# Altium project UZ_PER_SKAI3_LV_48V_410A.PrjPCB (part 2 of 2)

## Sheet Power.SchDoc
size A4; Author: D. Hufnagel; CompanyName: Technische Hochschule Nürnberg Georg Simon Ohm; Organization: UltraZohm; Address1: Kesslerplatz 12; Address2: 90489 Nürnberg; Address3: GERMANY; SheetNumber: 4; SheetTotal: 7; Website: www.ultrazohm.com
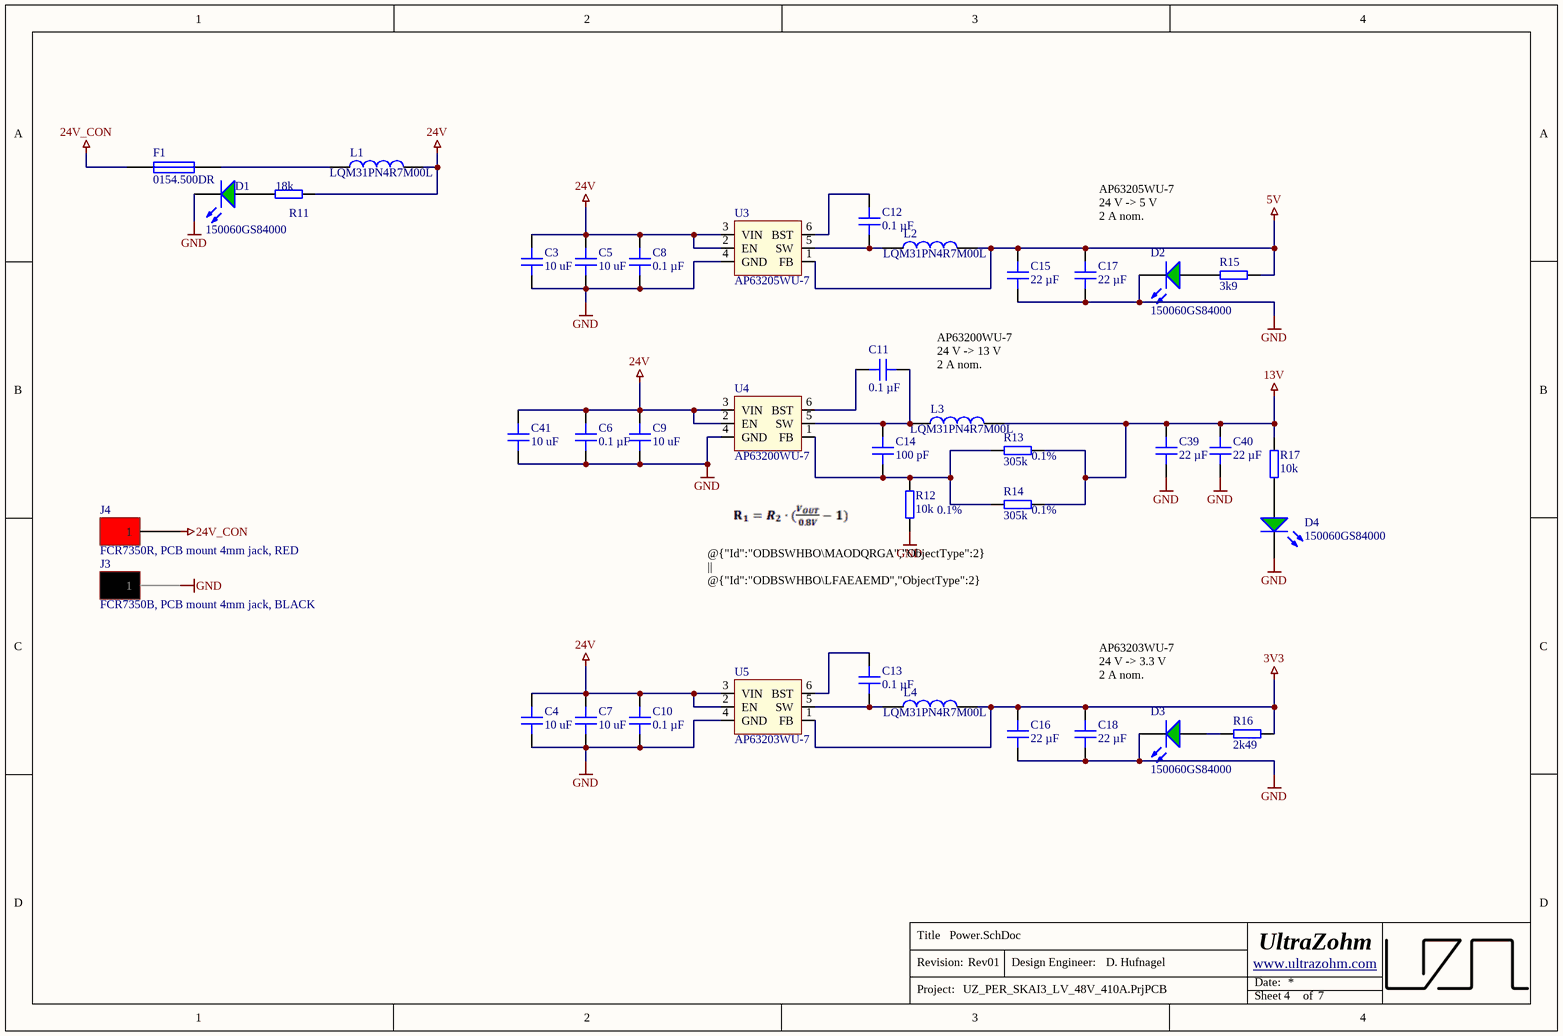
[diagram p6: Power.SchDoc]

### Parts
C3  10 uF  [C_1206]
C4  10 uF  [C_1206]
C5  10 uF  [C_1206]
C6  0.1 µF  [C_0603]
C7  10 uF  [C_1206]
C8  0.1 µF  [C_0603]
C9  10 uF  [C_1206]
C10  0.1 µF  [C_0603]
C11  0.1 µF  [C_0603]
C12  0.1 µF  [C_0603]
C13  0.1 µF  [C_0603]
C14  100 pF  [C_0603]
C15  22 µF  [C_0805]
C16  22 µF  [C_0805]
C17  22 µF  [C_0805]
C18  22 µF  [C_0805]
C39  22 µF  [C_0805]
C40  22 µF  [C_0805]
C41  10 uF  [C_1206]
D1  150060GS84000  [WL-SMCW_0603]
D2  150060GS84000  [WL-SMCW_0603]
D3  150060GS84000  [WL-SMCW_0603]
D4  150060GS84000  [WL-SMCW_0603]
F1  0154.500DR  [Littlefuse_154]
J3  FCR7350B, PCB mount 4mm jack, BLACK  [FCR7350]
J4  FCR7350R, PCB mount 4mm jack, RED  [FCR7350]
L1  LQM31PN4R7M00L  [IND 1206_3216]
L2  LQM31PN4R7M00L  [IND 1206_3216]
L3  LQM31PN4R7M00L  [IND 1206_3216]
L4  LQM31PN4R7M00L  [IND 1206_3216]
R11  18k  [RES 0603_1608]
R12  10k  Tolerance: 0.1%  [RES 0603_1608]
R13  305k  Tolerance: 0.1%  [RES 0603_1608]
R14  305k  Tolerance: 0.1%  [RES 0603_1608]
R15  3k9  [RES 0603_1608]
R16  2k49  [RES 0603_1608]
R17  10k  [RES 0603_1608]
U3  AP63205WU-7  [TSOT26-6]
U4  AP63200WU-7  [TSOT26-6]
U5  AP63203WU-7  [TSOT26-6]

### Nets
3V3: C16.2 C18.2 L4.2 R16.2 U5.1(FB)
5V: C15.2 C17.2 L2.2 R15.2 U3.1(FB)
13V: C39.2 C40.2 L3.2 R13.2 R14.2 R17.2
24V: C3.2 C4.2 C5.2 C6.2 C7.2 C8.2 C9.2 C10.2 C41.2 L1.2 R11.2 U3.2(EN) U3.3(VIN) U4.2(EN) U4.3(VIN) U5.2(EN) U5.3(VIN)
24V_CON: F1.1 J4.1
GND: C3.1 C4.1 C5.1 C6.1 C7.1 C8.1 C9.1 C10.1 C15.1 C16.1 C17.1 C18.1 C39.1 C40.1 C41.1 D1.1(K) D2.1(K) D3.1(K) D4.1(K) J3.1 R12.1 U3.4(GND) U4.4(GND) U5.4(GND)
NetC11_1: C11.1 C14.2 L3.1 U4.5(SW)
NetC11_2: C11.2 U4.6(BST)
NetC12_1: C12.1 L2.1 U3.5(SW)
NetC12_2: C12.2 U3.6(BST)
NetC13_1: C13.1 L4.1 U5.5(SW)
NetC13_2: C13.2 U5.6(BST)
NetC14_1: C14.1 R12.2 R13.1 R14.1 U4.1(FB)
NetD1_2: D1.2(A) R11.1
NetD2_2: D2.2(A) R15.1
NetD3_2: D3.2(A) R16.1
NetD4_2: D4.2(A) R17.1
NetF1_2: F1.2 L1.1

### Notes on the sheet
- AP63205WU-7
  24 V -> 5 V
  2 A nom.
- AP63200WU-7
  24 V -> 13 V
  2 A nom.
- (near R12) @{"Id":"ODBSWHBO\MAODQRGA","ObjectType":2} || @{"Id":"ODBSWHBO\LFAEAEMD","ObjectType":2} = @{"Id":"ODBSWHBO\ZRFRVKWZ","ObjectType":2} * (13/0.8 - 1)
  305k||305k= 10k * (13/0.8 -1)
  152,5k = 10k * (13/0.8 -1)
- AP63203WU-7
  24 V -> 3.3 V
  2 A nom.
- Title
- Revision:
- Design Engineer:
- Date:
- Project:
- Sheet
- of

### Library data of the parts
C3-C5 C7 C9 C41 = CL31B106KBHNNNE: 50V 10uF X7R ±10% 1206  Multilayer Ceramic Capacitors MLCC - SMD/SMT ROHS; Manufacturer: Samsung Electro-Mechanics; Voltage Rating: 50 VDC; Created from: AGeiger; Manufacturer Part Number: CL31B106KBHNNNE; PartID: 107; Created On: 20.09.2022 20:14:50; ComponentLink1Description: Datasheet; ComponentLink1URL: https://datasheet.lcsc.com/lcsc/1810221111_Samsung-Electro-Mechanics-CL31B106KBHNNNE_C89632.pdf; Component Type: Capacitor 1206; Device Package: 1206; Last Updated: 20.09.2022 20:14:50; Mounting Type: SMD; Operating Temperature: -55 - 125°C; Series: X7R; Supplier 1: LCSC; Supplier Part Number 1: C89632; Type: Capacitor; Tolerance: 10 %; Value: 10 uF; Live Cycle Status: 1; LCSC Part Number: C89632
C6 C8 C10-C13 = C0603X104K5RAC7411: Capacitor 0603, 50 VDC, 0.1 µF, X7R; Manufacturer: KEMET; Tolerance: 10 %; Voltage Rating: 50 VDC; Created from: MGremer; Manufacturer Part Number: C0603X104K5RAC7411; PartID: 3; Created On: 20.12.2020 13:54:13; ComponentLink1Description: Datasheet; ComponentLink1URL: https://www.mouser.de/datasheet/2/212/1/KEM_C1013_X7R_FT_CAP_SMD-1103280.pdf; Component Type: Capacitor 0603; Device Package: 0603; Last Updated: 04.03.2021 09:24:28; Mounting Type: SMD; Operating Temperature: -55 - 125°C; Series: SMD Comm X7R Flex; Supplier 1: Mouser; Supplier Part Number 1: 80-C0603X104K5R7411; Supplier 2: LCSC; Supplier Part Number 2: C14663; Type: Capacitor; Value: 0.1 µF; Live Cycle Status: 1; LCSC Part Number: C14663; Stock number: Labor SMD Container
C14 = CL10C101JB8NNNC: 50V 100pF C0G ±5% 0603 Multilayer Ceramic Capacitors MLCC - SMD/SMT ROHS; Manufacturer: Samsung Electro-Mechanics; Voltage Rating: 50 VDC; Created from: AGeiger; Manufacturer Part Number: CL10C101JB8NNNC; PartID: 106; Created On: 03.09.2022 10:55:28; ComponentLink1Description: Datasheet; ComponentLink1URL: https://datasheet.lcsc.com/lcsc/1811151136_Samsung-Electro-Mechanics-CL10C101JB8NNNC_C14858.pdf; Component Type: Capacitor 0603; Device Package: 0603; Last Updated: 03.09.2022 10:55:28; Mounting Type: SMD; Operating Temperature: -55 - 125°C; Series: C0G; Supplier 1: LCSC; Supplier Part Number 1: C14858; Type: Capacitor; Tolerance: 5 %; Value: 100 pF; Live Cycle Status: 1; LCSC Part Number: C14858
C15-C18 C39 C40 = GRT21BR61E226ME13L: Capacitor 0805, 25 VDC, 22 µF, X5R; Manufacturer: muRata; Tolerance: 20 %; Voltage Rating: 25 VDC; Created from: MGremer; Manufacturer Part Number: GRT21BR61E226ME13L; PartID: 12; Created On: 20.12.2020 13:54:13; ComponentLink1Description: Datasheet; ComponentLink1URL: https://www.mouser.de/datasheet/2/281/product-794362.pdf; Component Type: Capacitor 0805; Device Package: 0805; Last Updated: 24.10.2023 13:45:04; Mounting Type: SMD; Operating Temperature: -55 - 85°C; Series: GRT; Supplier 1: Mouser; Supplier Part Number 1: 81-GRT21BR61E226ME3L; Type: Capacitor; Value: 22 µF; Live Cycle Status: 1; LCSC Part Number: C2992614; Stock number: Labor SMD Container
D1-D4 = 150060GS84000: WL-SMCW SMD Mono-color Chip LED Waterclear Green; Manufacturer: Wuerth Elektronik; Type: Standard; Created from: MGremer; Forward Current I_f: 20 mA; Forward Voltage U_f: 3.2 V; Wavelength: 525 nm; Light Intensity: 3000 mcd; Nominal Power: 78 mW; Manufacturer Part Number: 150060GS84000; PartID: 2; Created On: 08.12.2020 10:41:11; ComponentLink1Description: Datasheet; ComponentLink1URL: https://www.mouser.de/datasheet/2/445/150060GS75020-1714345.pdf; Component Type: LED Diode; Device Package: 0603; Last Updated: 03.03.2021 09:59:51; Mounting Type: SMD; Operating Temperature: -40 - 85 °C; Supplier 1: Mouser; Supplier Part Number 1: 710-150060GS84000; Supplier 2: Farnell; Supplier Part Number 2: 3408612; Supplier 3: Digi-Key; Supplier Part Number 3: 732-150060GS84000CT-ND; Live Cycle Status: 1; Stock number: not stored; Color: green
F1 = 0154.500DR: Fuse OMNI BLOK 154; Manufacturer: Littlefuse; Nominal current: 500 mA; Nominal voltage AC: 125 VAC; Nominal voltage DC: 125 VDC; Resistance: 304.6 mOhm; Value: 500 mA; Created from: MGremer; Manufacturer Part Number: 0154.500DR; PartID: 2; Created On: 07.01.2021 10:17:19; ComponentLink1Description: Datasheet; ComponentLink1URL: https://www.mouser.de/datasheet/2/240/Littelfuse_Fuse_154_154T_154L_154TL_Datasheet_pdf-365375.pdf; Component Type: NAN02 - 154 OMNI-BLOK; Device Package: OMNI-BLOK; Last Updated: 07.01.2021 10:22:49; Mounting Type: SMD; Operating Temperature: -55 - 125 °C; Series: 154; Supplier 1: Mouser; Supplier Part Number 1: 576-0154.500DR; Type: Fuse; Live Cycle Status: 1
J3 = FCR7350B: FCR7350B, 1000V, 24A, BLACK; Manufacturer: Cliff; Value: PCB mount 4mm jack, Black	FCR7350B, 1000V, 24A; Created from: DHufnagel; Manufacturer Part Number: FCR7350B; PartID: 6; Created On: 13.06.2022 10:18:11; ComponentLink1Description: datasheet; ComponentLink1URL: https://www.cliffuk.co.uk/products/testleads/sockets/S16NPC.pdf; ComponentLink2Description: drawing; ComponentLink2URL: https://media.digikey.com/pdf/Data%20Sheets/Cliff%20Electronic%20LTD%20PDF's/FCR7350_Drawing.pdf; Component Type: PCB mount 4mm jack, Black; Device Package: THT; Last Updated: 21.02.2024 15:21:29; Minimum Order: 1; Mounting Type: THT; Operating Temperature: -40°C - 80°C; Series: S16N-PC; Supplier 1: Digi-Key; Supplier Part Number 1: 3185-FCR7350B-ND; Supplier 2: farnell; Supplier Part Number 2: 1854507; Supplier 3: LCSC; Supplier Part Number 3: C7437327; Type: PCB mount 4mm jack, Black	FCR7350B, 1000V, 24A; Live Cycle Status: 1; LCSC Part Number: C7437327; Stock number: not stored
J4 = FCR7350R: FCR7350B, 1000V, 24A, RED; Manufacturer: Cliff; Value: PCB mount 4mm jack, Red FCR7350R, 1000V, 24A; Created from: DHufnagel; Manufacturer Part Number: FCR7350R; PartID: 7; Created On: 13.06.2022 10:18:11; ComponentLink1Description: datasheet; ComponentLink1URL: https://www.cliffuk.co.uk/products/testleads/sockets/S16NPC.pdf; ComponentLink2Description: drawing; ComponentLink2URL: https://media.digikey.com/pdf/Data%20Sheets/Cliff%20Electronic%20LTD%20PDF's/FCR7350_Drawing.pdf; Component Type: PCB mount 4mm jack, Red; Device Package: THT; Last Updated: 21.02.2024 15:19:13; Minimum Order: 1; Mounting Type: THT; Operating Temperature: -40°C - 80°C; Series: S16N-PC; Supplier 1: Digi-Key; Supplier Part Number 1: 3185-FCR7350R-ND; Supplier 2: farnell; Supplier Part Number 2: 1854508; Supplier 3: LCSC; Supplier Part Number 3: C7437326; Type: PCB mount 4mm jack, Red FCR7350R, 1000V, 24A; Live Cycle Status: 1; LCSC Part Number: C7437326; Stock number: not stored
L1-L4 = LQM31PN4R7M00L: Power Inductors - SMD 4.7 UH 20%; Manufacturer: Murata; MF: EPCOS / TDK; Value: 4.7 uH; DCR: 320m; Rated Current: 0.85 A; Type: Inductance SMD; DC current: 700 mA; Created from: VStarost; MPN: B82464G4154M; Supplier 1: Mouser; Supplier Part Number 1: 81-LQM31PN4R7M00L; Manufacturer Part Number: LQM31PN4R7M00L; PartID: 14; Created On: 21.12.2022 14:39:27; ComponentLink1Description: Datasheet; ComponentLink1URL: https://www.mouser.de/datasheet/2/281/1/JELF243B_0013-1634236.pdf; Component Type: Inductance; Device Package: 1206; Last Updated: 15.02.2023 18:04:47; Mounting Type: SMD; Operating Temperature: -55 - 125 °C; Series: LQM; Live Cycle Status: 1; LCSC Part Number: C162588; Stock number: not stored
R11 = RK73B1JTTD183J: SMD resistor E24 series; Manufacturer: KOA Speer; Tolerance: 5%; Created from: MGremer; Manufacturer Part Number: RK73B1JTTD183J; PartID: 104; Created On: 14.12.2020 16:17:14; ComponentLink1Description: Datasheet; ComponentLink1URL: https://www.mouser.de/datasheet/2/219/RK73B-1825463.pdf; Component Type: SMD resistor; Device Package: 0603; Last Updated: 15.02.2023 17:57:37; Mounting Type: SMD; Supplier 1: Mouser; Supplier Part Number 1: 660-RK73B1JTTD183J; Type: Resistor; Value: 18k; Live Cycle Status: 1; Stock number: Labor SMD Container; LCSC Part Number: C177285
R12 R17 = RQ73C1J10KBTD: SMD resistor 0.1%, 10ppm; Manufacturer: TE Connectivity; Created from: DHufnagel; Manufacturer Part Number: RQ73C1J10KBTD; PartID: 231; Created On: 14.12.2020 16:17:14; ComponentLink1Description: Datasheet; ComponentLink1URL: https://www.mouser.de/datasheet/2/418/5/ENG_DS_1773270_2_B-1533717.pdf; Component Type: SMD resistor; Device Package: 0603; Last Updated: 21.02.2024 15:51:17; Mounting Type: SMD; Supplier 1: Mouser; Supplier Part Number 1: 279-RQ73C1J10KBTD; Supplier 2: LCSC; Supplier Part Number 2: C95204; Type: Resistor; Value: 10k; Live Cycle Status: 1; Stock number: not stored; LCSC Part Number: C95204
  R17: Tolerance: 0.1%
R13 R14 = RN73R1JTTD3053B25: SMD resistor 0.1%; Manufacturer: KOA Speer; Created from: DHufnagel; Manufacturer Part Number: RN73R1JTTD3053B25; PartID: 337; Created On: 01.12.2022 09:50:56; ComponentLink1Description: Datasheet; ComponentLink1URL: https://www.koaspeer.com/pdfs/RN73R.pdf; Component Type: SMD resistor; Device Package: 0603; Last Updated: 01.12.2022 09:50:56; Mounting Type: SMD; Supplier 1: Mouser; Supplier Part Number 1: 660-RN73R1JTD3053B25; Type: Resistor; Value: 305k; Live Cycle Status: 1; Stock number: not stored
R15 = RT0603FRE073K9L: SMD resistor E24 series; Manufacturer: YAGEO; Tolerance: 1%; Created from: DHufnagel; Manufacturer Part Number: RT0603FRE073K9L; PartID: 250; Created On: 14.12.2020 16:17:14; ComponentLink1Description: Datasheet; ComponentLink1URL: https://www.mouser.de/datasheet/2/447/PYu_RT_1_to_0_01_RoHS_L_12-3003070.pdf; Component Type: SMD resistor; Device Package: 0603; Last Updated: 05.07.2023 18:34:06; Mounting Type: SMD; Supplier 1: Mouser; Supplier Part Number 1: 603-RT0603FRE073K9L; Type: Resistor; Value: 3k9; Live Cycle Status: 1; Stock number: not stored; LCSC Part Number: C863790
R16 = RC0603FR-072K49L: SMD resistor 1%; Manufacturer: Yageo; Created from: AGeiger; Manufacturer Part Number: RC0603FR-072K49L; PartID: 272; Created On: 12.06.2023 15:33:58; ComponentLink1Description: Datasheet; ComponentLink1URL: https://datasheet.lcsc.com/lcsc/2304140030_YAGEO-RC0603FR-072K49L_C108190.pdf; Component Type: SMD resistor; Device Package: 0603; Last Updated: 12.06.2023 15:33:58; Mounting Type: SMD; Supplier 1: LCSC; Supplier Part Number 1: C108190; Type: Resistor; Tolerance: 1%; Value: 2k49; Live Cycle Status: 1; LCSC Part Number: C108190
U3 = AP63205WU-7: Switching Voltage Regulators DCDC Conv HV Buck TSOT26 T&R 3K; Manufacturer: Diodes Incorporate; Created from: VStarost; Manufacturer Part Number: AP63205WU-7; PartID: 2; Created On: 13.12.2022 12:26:50; ComponentLink1Description: Datasheet; ComponentLink1URL: https://www.mouser.de/datasheet/2/115/DIOD_S_A0007089856_1-2542907.pdf; Component Type: Buck Converter; Last Updated: 13.12.2022 12:26:50; Mounting Type: SMD; Operating Temperature: -40 - 85 °C; Supplier 1: Mouser; Supplier Part Number 1: 621-AP63205WU-7; Type: Switching Regulator; Live Cycle Status: 1; Stock number: not stored
U4 = AP63200WU-7: Switching Voltage Regulators DCDC Conv HV Buck TSOT26 T&R 3K; Manufacturer: Diodes Incorporate; Created from: VStarost; Manufacturer Part Number: AP63200WU-7; PartID: 3; Created On: 13.12.2022 12:26:50; ComponentLink1Description: Datasheet; ComponentLink1URL: https://www.mouser.de/datasheet/2/115/DIOD_S_A0007089856_1-2542907.pdf; Component Type: Buck Converter; Last Updated: 13.12.2022 12:26:50; Mounting Type: SMD; Operating Temperature: -40 - 85 °C; Supplier 1: Mouser; Supplier Part Number 1: 621-AP63200WU-7; Type: Switching Regulator; Live Cycle Status: 1; Stock number: not stored
U5 = AP63203WU-7: Switching Voltage Regulators DCDC Conv HV Buck TSOT26 T&R 3K; Manufacturer: Diodes Incorporate; Created from: DHufnagel; Manufacturer Part Number: AP63203WU-7; PartID: 4; Created On: 13.12.2022 12:26:50; ComponentLink1Description: Datasheet; ComponentLink1URL: https://www.mouser.de/datasheet/2/115/DIOD_S_A0007089856_1-2542907.pdf; Component Type: Buck Converter; Last Updated: 13.12.2022 12:26:50; Mounting Type: SMD; Operating Temperature: -40 - 85 °C; Supplier 1: Mouser; Supplier Part Number 1: 621-AP63203WU-7; Type: Switching Regulator; Live Cycle Status: 1; LCSC Part Number: C780769; Stock number: not stored

## Nets that join several sheets
3V3: Receiver (8 pins), Power (5 pins)
5V: Temp_V_DC_Measurement (L5.1 L6.1 R29.2), Connectors (X22.20), Curr_Volt_Measurement1 (L7A.1 L8A.1), Curr_Volt_Measurement2 (L7B.1 L8B.1), Curr_Volt_Measurement3 (L7C.1 L8C.1), Transmitter (5 pins), Power (5 pins)
13V: Connectors (X21.4 X21.8), Power (6 pins)
GND: Temp_V_DC_Measurement (10 pins), Connectors (9 pins), Curr_Volt_Measurement1 (8 pins), Curr_Volt_Measurement2 (8 pins), Curr_Volt_Measurement3 (8 pins), Receiver (C1.1 C2.1 U1.8 U2.8), Transmitter (C38.1 U10.8 U10.12), Power (24 pins)
ENABLE_PWM: Connectors (X21.2), Receiver (U2.11)
ENABLE_PWM_N: Connectors (X1.23), Receiver (R9.1 U2.9)
ENABLE_PWM_P: Connectors (X1.8), Receiver (R9.2 U2.10)
ERR_REG_CLK: Connectors (X21.16), Transmitter (U10.1)
ERR_REG_CLK_N: Connectors (X1.26), Transmitter (R43.2)
ERR_REG_CLK_P: Connectors (X1.11), Transmitter (R42.2)
I_OUT_N: Connectors (J1.2), Curr_Volt_Measurement1 (R31A.1)
I_OUT_N: Connectors (J1.6), Curr_Volt_Measurement2 (R31B.1)
I_OUT_N: Connectors (J1.5), Curr_Volt_Measurement3 (R31C.1)
I_OUT_P: Connectors (J1.1), Curr_Volt_Measurement1 (R32A.1)
I_OUT_P: Connectors (J1.3), Curr_Volt_Measurement2 (R32B.1)
I_OUT_P: Connectors (J1.4), Curr_Volt_Measurement3 (R32C.1)
MOS_TEMP: Temp_V_DC_Measurement (C28.2 R26.1 R29.1), Connectors (X22.6)
MOS_TEMP_OUT_N: Temp_V_DC_Measurement (R18.1), Connectors (J2.8)
MOS_TEMP_OUT_P: Temp_V_DC_Measurement (R19.1), Connectors (J2.7)
nErrOUT: Connectors (X21.18), Transmitter (R49.1 U10.7)
nErrOUT_N: Connectors (X1.27), Transmitter (R45.2)
nErrOUT_P: Connectors (X1.12), Transmitter (R44.2)
nERROUT_REG: Connectors (X21.20), Transmitter (R50.1 U10.9)
nERROUT_REG_N: Connectors (X1.28), Transmitter (R47.2)
nERROUT_REG_P: Connectors (X1.13), Transmitter (R46.2)
NetC25_2: Temp_V_DC_Measurement (C25.2 C27.2 R24.2 U7.8), Connectors (X21.3)
PHASE_CURRENT_CON_1: Connectors (X22.17), Curr_Volt_Measurement1 (R40A.2)
PHASE_CURRENT_CON_2: Connectors (X22.15), Curr_Volt_Measurement2 (R40B.2)
PHASE_CURRENT_CON_3: Connectors (X22.13), Curr_Volt_Measurement3 (R40C.2)
PHASE_REFERENCE_CON_1: Connectors (X22.18), Curr_Volt_Measurement1 (R39A.2)
PHASE_REFERENCE_CON_2: Connectors (X22.16), Curr_Volt_Measurement2 (R39B.2)
PHASE_REFERENCE_CON_3: Connectors (X22.14), Curr_Volt_Measurement3 (R39C.2)
PHASE_VOLTAGE_CON_1: Connectors (X21.7), Curr_Volt_Measurement1 (C35A.2 C37A.2 R37A.2 U9A.8)
PHASE_VOLTAGE_CON_2: Connectors (X21.6), Curr_Volt_Measurement2 (C35B.2 C37B.2 R37B.2 U9B.8)
PHASE_VOLTAGE_CON_3: Connectors (X21.5), Curr_Volt_Measurement3 (C35C.2 C37C.2 R37C.2 U9C.8)
PWM_BOT1: Connectors (X21.14), Receiver (U1.5)
PWM_BOT2: Connectors (X21.12), Receiver (U1.13)
PWM_BOT3: Connectors (X21.10), Receiver (U2.5)
PWM_BOT_N1: Connectors (X1.18), Receiver (R4.1 U1.7)
PWM_BOT_N2: Connectors (X1.20), Receiver (R6.1 U1.15)
PWM_BOT_N3: Connectors (X1.22), Receiver (R8.1 U2.7)
PWM_BOT_P1: Connectors (X1.3), Receiver (R4.2 U1.6)
PWM_BOT_P2: Connectors (X1.5), Receiver (R6.2 U1.14)
PWM_BOT_P3: Connectors (X1.7), Receiver (R8.2 U2.6)
PWM_TOP1: Connectors (X21.15), Receiver (U1.3)
PWM_TOP2: Connectors (X21.13), Receiver (U1.11)
PWM_TOP3: Connectors (X21.11), Receiver (U2.3)
PWM_TOP_N1: Connectors (X1.17), Receiver (R3.1 U1.1)
PWM_TOP_N2: Connectors (X1.19), Receiver (R5.1 U1.9)
PWM_TOP_N3: Connectors (X1.21), Receiver (R7.1 U2.1)
PWM_TOP_P1: Connectors (X1.2), Receiver (R3.2 U1.2)
PWM_TOP_P2: Connectors (X1.4), Receiver (R5.2 U1.10)
PWM_TOP_P3: Connectors (X1.6), Receiver (R7.2 U2.2)
RESET: Connectors (X21.19), Receiver (U2.13)
RESET_N: Connectors (X1.24), Receiver (R10.1 U2.15)
RESET_P: Connectors (X1.9), Receiver (R10.2 U2.14)
T_DCB_NEG: Temp_V_DC_Measurement (C28.1 R30.2), Connectors (X22.5)
U_DC_OUT_N: Temp_V_DC_Measurement (R20.1), Connectors (J1.8)
U_DC_OUT_P: Temp_V_DC_Measurement (R21.1), Connectors (J1.7)
U_OUT_N: Connectors (J2.2), Curr_Volt_Measurement1 (R33A.1)
U_OUT_N: Connectors (J2.6), Curr_Volt_Measurement2 (R33B.1)
U_OUT_N: Connectors (J2.5), Curr_Volt_Measurement3 (R33C.1)
U_OUT_P: Connectors (J2.1), Curr_Volt_Measurement1 (R34A.1)
U_OUT_P: Connectors (J2.3), Curr_Volt_Measurement2 (R34B.1)
U_OUT_P: Connectors (J2.4), Curr_Volt_Measurement3 (R34C.1)

## Assembly variants
Default: all parts fitted
NoTerminationsFitted: not fitted R3 R4 R5 R6 R7 R8 R9 R10